# Altium schematic sheet [1] ESP32-S3.SchDoc
size B; Organization: Altium Limited; Address1: L3, 12a Rodborough Rd; Address2: Frenchs Forest; Address3: NSW; Address4: Australia 2086
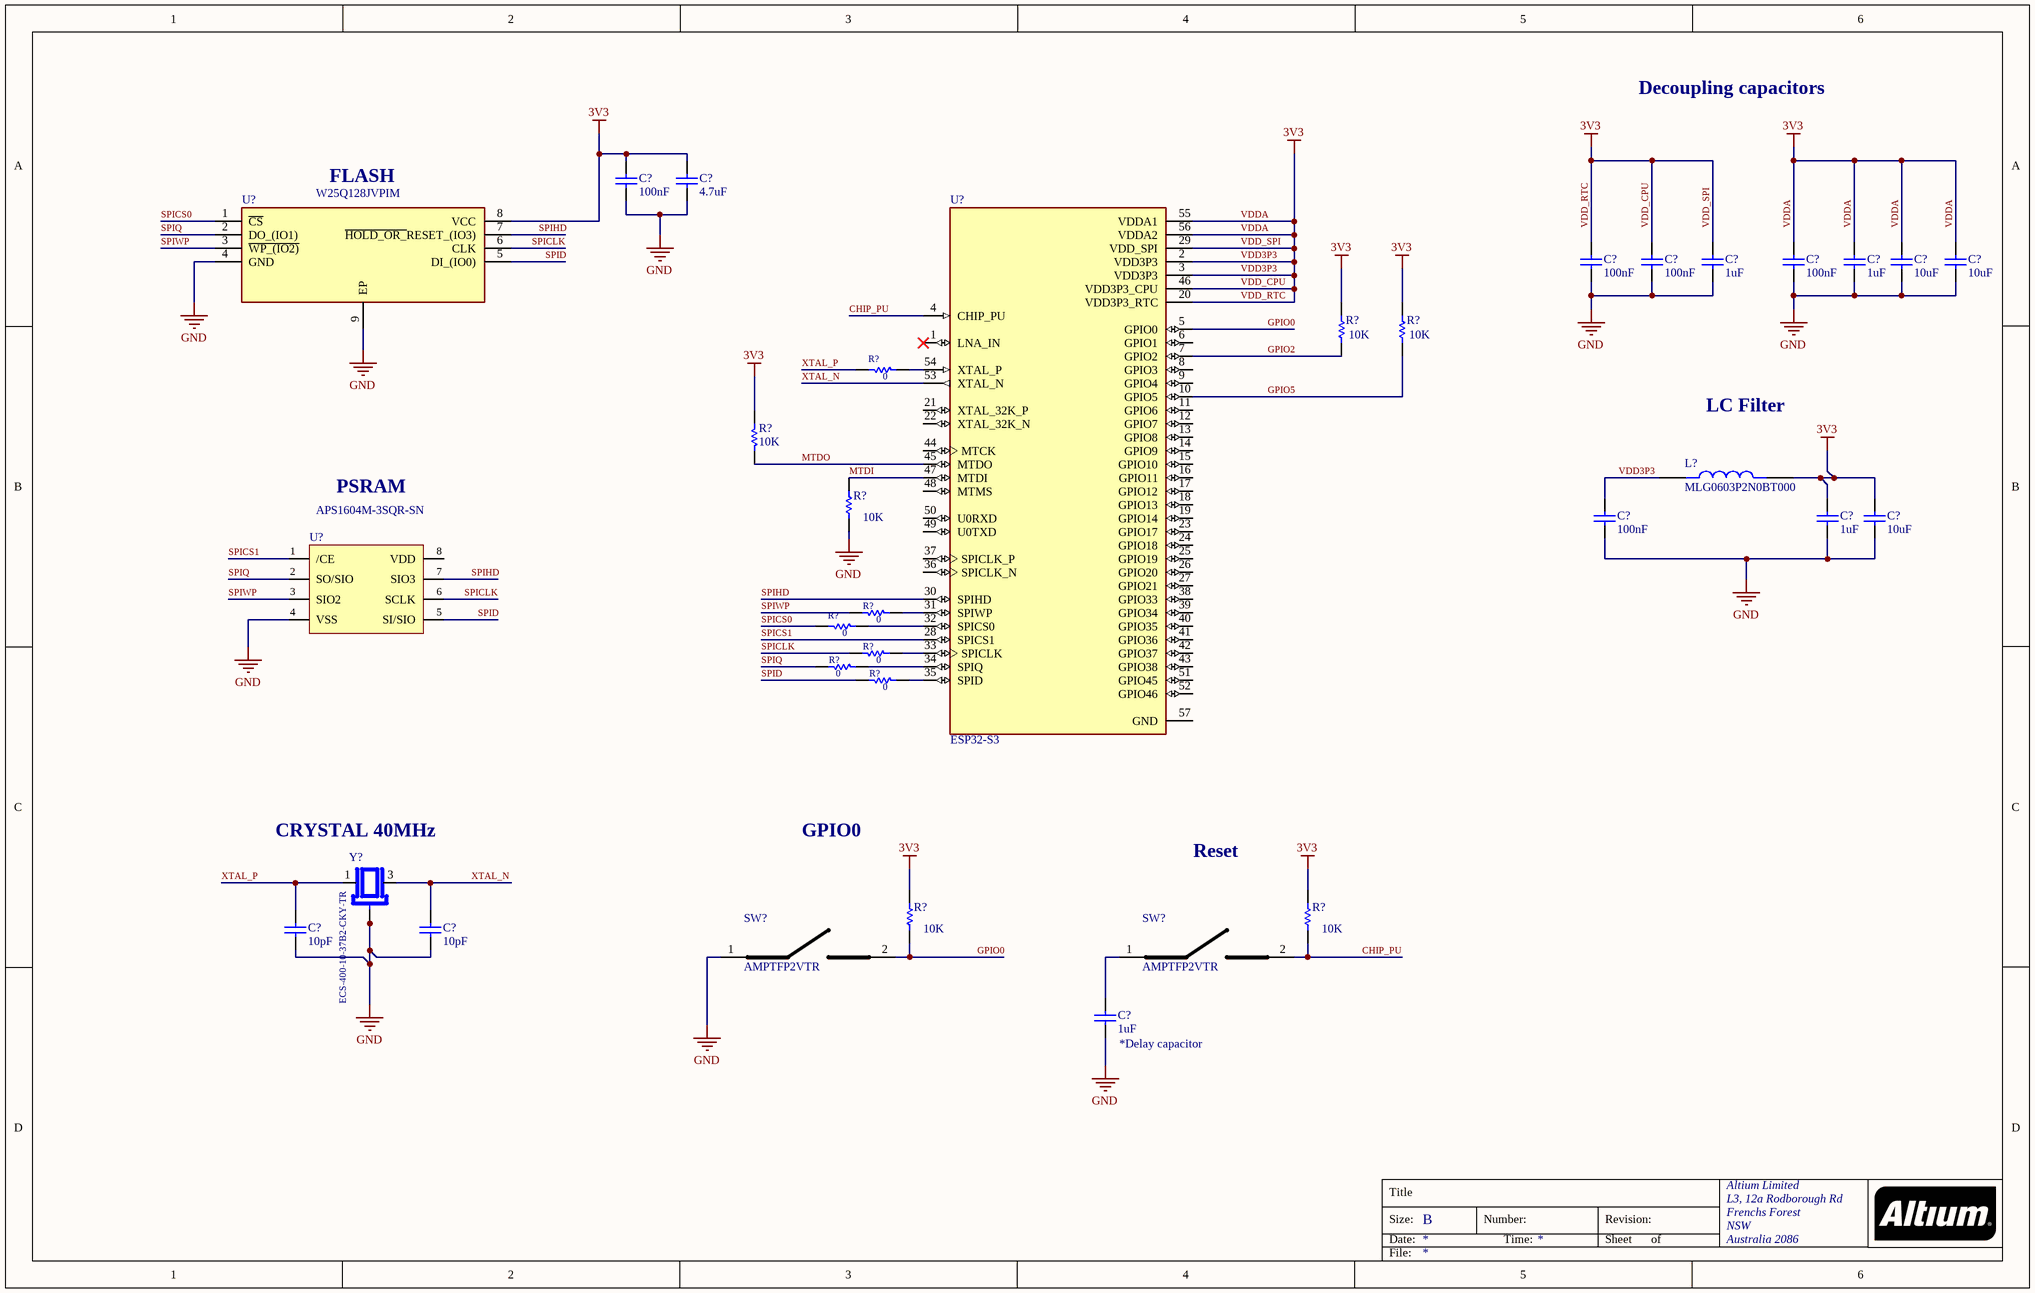
[diagram p0: [1] ESP32-S3.SchDoc]

## Parts
(Parts that share a designator on the sheet are numbered #1, #2 ... from top to bottom, then left to right.)
C?#1  100nF  [Capacitor 0402]
C?#2  4.7uF  [Capacitor 0402]
C?#3  100nF  [Capacitor 0402]
C?#4  100nF  [Capacitor 0402]
C?#5  1uF  [Capacitor 0402]
C?#6  100nF  [Capacitor 0402]
C?#7  1uF  [Capacitor 0402]
C?#8  10uF  [Capacitor 0603]
C?#9  10uF  [Capacitor 0603]
C?#10  100nF  [Capacitor 0402]
C?#11  1uF  [Capacitor 0402]
C?#12  10uF  [Capacitor 0603]
C?#13  10pF  [Capacitor 0402]
C?#14  10pF  [Capacitor 0402]
C?#15  1uF  [Capacitor 0402]
L?  MLG0603P2N0BT000  [INDC0603X33N]
R?#1  10K  [Resistencia 0402]
R?#2  10K  [Resistencia 0402]
R?#3  0  [Resistencia 0402]
R?#4  10K  [Resistencia 0402]
R?#5  10K  [Resistencia 0402]
R?#6  0  [Resistencia 0402]
R?#7  0  [Resistencia 0402]
R?#8  0  [Resistencia 0402]
R?#9  0  [Resistencia 0402]
R?#10  0  [Resistencia 0402]
R?#11  10K  [Resistencia 0402]
R?#12  10K  [Resistencia 0402]
SW?#1  AMPTFP2VTR  [AMPTFP2VTR]
SW?#2  AMPTFP2VTR  [AMPTFP2VTR]
U?#1  W25Q128JVPIM  [SON127P600X500X80-9N-D]
U?#2  ESP32-S3  [IC_ESP32-S3]
U?#3  APS1604M-3SQR-SN  [SOIC127P600X165-8N]
Y?  ECS-400-10-37B2-CKY-TR  [XTAL_ECS-400-10-37B2-CKY-TR]

## Nets
GND: C?#1.1 C?#2.1 C?#3.1 C?#4.1 C?#5.1 C?#6.1 C?#7.1 C?#8.1 C?#9.1 C?#10.1 C?#11.1 C?#12.1 C?#13.1 C?#14.1 C?#15.1 R?#5.1(A) SW?#1.1(COM) U?#1.4(GND) U?#1.9(EP) U?#3.4(VSS) Y?.2(GND) Y?.4(GND)
VDD3P3: C?#1.2 C?#2.2 C?#3.2 C?#4.2 C?#5.2 C?#6.2 C?#7.2 C?#8.2 C?#9.2 C?#10.2 C?#11.2 C?#12.2 L?.1 L?.2 R?#1.2(B) R?#2.2(B) R?#4.2(B) R?#11.2(B) R?#12.2(B) U?#1.8(VCC) U?#2.2(VDD3P3) U?#2.3(VDD3P3) U?#2.20(VDD3P3_RTC) U?#2.29(VDD_SPI) U?#2.46(VDD3P3_CPU) U?#2.55(VDDA1) U?#2.56(VDDA2)  [also labelled 3V3, VDD_CPU, VDD_RTC, VDD_SPI, VDDA]
CHIP_PU: R?#12.1(A) SW?#2.2(NO) U?#2.4(CHIP_PU)
GPIO0: R?#11.1(A) SW?#1.2(NO) U?#2.5(GPIO0)
GPIO2: R?#1.1(A) U?#2.7(GPIO2)
GPIO5: R?#2.1(A) U?#2.10(GPIO5)
MTDI: R?#5.2(B) U?#2.47(MTDI)
MTDO: R?#4.1(A) U?#2.45(MTDO)
SPICLK: R?#8.2(B) U?#1.6(CLK) U?#3.6(SCLK)
SPICS0: R?#7.1(A) U?#1.1(~{CS})
SPICS1: U?#2.28(SPICS1) U?#3.1(/CE)
SPID: R?#10.2(B) U?#1.5(DI_(IO0)) U?#3.5(SI/SIO)
SPIHD: U?#1.7(~{HOLD_OR_}RESET_(IO3)) U?#2.30(SPIHD) U?#3.7(SIO3)
SPIQ: R?#9.2(B) U?#1.2(DO_(IO1)) U?#3.2(SO/SIO)
SPIWP: R?#6.2(B) U?#1.3(~{WP_(IO2)}) U?#3.3(SIO2)
XTAL_N: C?#14.2 U?#2.53(XTAL_N) Y?.3(OUT/IN)
XTAL_P: C?#13.2 R?#3.2(B) Y?.1(IN/OUT)
NetC?#15_2: C?#15.2 SW?#2.1(COM)
NetR?#3_1: R?#3.1(A) U?#2.54(XTAL_P)
NetR?#6_1: R?#6.1(A) U?#2.31(SPIWP)
NetR?#7_2: R?#7.2(B) U?#2.32(SPICS0)
NetR?#8_1: R?#8.1(A) U?#2.33(SPICLK)
NetR?#9_1: R?#9.1(A) U?#2.34(SPIQ)
NetR?#10_1: R?#10.1(A) U?#2.35(SPID)

Not connected (* = marked no-connect by the designer): U?#2 1(LNA_IN)* 6(GPIO1) 8(GPIO3) 9(GPIO4) 11(GPIO6) 12(GPIO7) 13(GPIO8) 14(GPIO9) 15(GPIO10) 16(GPIO11) 17(GPIO12) 18(GPIO13) 19(GPIO14) 21(XTAL_32K_P) 22(XTAL_32K_N) 23(GPIO17) 24(GPIO18) 25(GPIO19) 26(GPIO20) 27(GPIO21) 36(SPICLK_N) 37(SPICLK_P) 38(GPIO33) 39(GPIO34) 40(GPIO35) 41(GPIO36) 42(GPIO37) 43(GPIO38) 44(MTCK) 48(MTMS) 49(U0TXD) 50(U0RXD) 51(GPIO45) 52(GPIO46) 57(GND); U?#3 8(VDD)

## Notes on the sheet
- Decoupling capacitors
- (near U?#1) FLASH
- LC Filter
- PSRAM
- (near Y?) CRYSTAL 40MHz
- GPIO0
- Reset
- (near C?#15) *Delay capacitor
- Title
- Size:
- Date:
- B
- Number:
- Time:
- Revision:
- Sheet
- of
- File:

## Library data of the parts
C?#1-C?#7 C?#10 C?#11 C?#13-C?#15 = Capacitor 0402: Capacitor Ceramico SMD 0402
C?#8 C?#9 C?#12 = Capacitor 0603: Capacitor Ceramico SMD 0603
L? = MLG0603P2N0BT000: 2 nH Unshielded Multilayer Inductor 600 mA 100mOhm Max 0201 (0603 Metric); MF: TDK; Price: None; Check_prices: https://www.snapeda.com/parts/MLG0603P2N0BT000/TDK/view-part/?ref=eda; Package: 0603 Taiyo Yuden; Purchase-URL: https://pricing.snapeda.com/search/part/MLG0603P2N0BT000/?ref=eda; SnapEDA_Link: https://www.snapeda.com/parts/MLG0603P2N0BT000/TDK/view-part/?ref=snap; Value: *; MP: MLG0603P2N0BT000; Availability: In Stock
R?#1-R?#12 = Resistencia SMD 0402
SW?#1 SW?#2 = AMPTFP2VTR: Tactile Switch SPST-NO Top Actuated Surface Mount; Manufacturer_Name: Apem; Geometry.Height: 2.2mm; Mouser Part Number: 642-AMPTFP2VTR; Mouser Price/Stock: https://www.mouser.co.uk/ProductDetail/Apem/AMPTFP2VTR?qs=%252B9%2Fcbd0IE0SYwG%252BIJFZl2Q%3D%3D; Manufacturer_Part_Number: AMPTFP2VTR; Datasheet Link: https://www.mouser.se/datasheet/2/26/apem_appms00196-1-1733699.pdf
U?#1 = W25Q128JVPIM: 128M-bit Serial Flash Memory with uniform 4KB sectors and Dual/Quad SPI; Manufacturer_Name: Winbond; Geometry.Height: 0.8mm; Mouser Part Number: 454-W25Q128JVPIM; Mouser Price/Stock: https://www.mouser.co.uk/ProductDetail/Winbond/W25Q128JVPIM?qs=qSfuJ%252Bfl%2Fd62hi5N%252Bd7%252B%252BA%3D%3D; Manufacturer_Part_Number: W25Q128JVPIM; Datasheet Link: https://www.winbond.com/hq/search-resource-file.jsp?partNo=W25Q128JVPIM&type=datasheet
U?#2 = ESP32-S3: IC RF TxRx + MCU Bluetooth, WiFi 802.11b/g/n, Bluetooth v5.0 2.412GHz ~ 2.484GHz 56-VFQFN Exposed Pad; MF: Espressif Systems; Check_prices: https://www.snapeda.com/parts/ESP32-S3/Espressif+Systems/view-part/?ref=eda; Purchase-URL: https://pricing.snapeda.com/search/part/ESP32-S3/?ref=eda; Value: *; Availability: In Stock; Package: None; SnapEDA_Link: https://www.snapeda.com/parts/ESP32-S3/Espressif+Systems/view-part/?ref=snap; MP: ESP32-S3; Price: None
U?#3 = APS1604M-3SQR-SN: DRAM IoT RAM 16Mb QSPI (x1,x4) SDR 133/84MHz, RBX, 3V, Ind. Temp., SOP8
Y? = ECS-400-10-37B2-CKY-TR: Package: None; Price: None; Value: *; MP: ECS-400-10-37B2-CKY-TR; Availability: Unavailable